# EasyEDA Pro project ProDoc_面部追踪摄像头主控板.epro, board PCB2
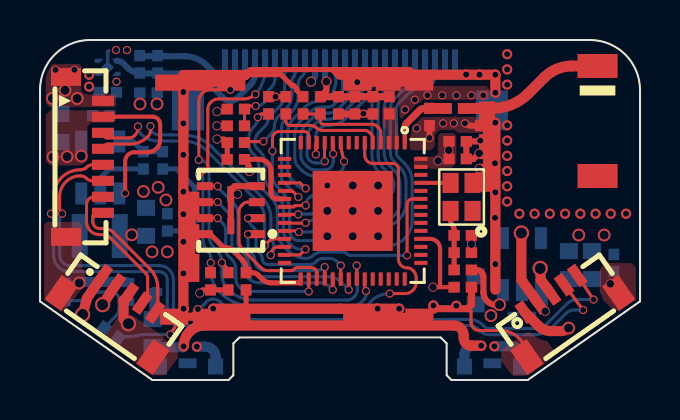
[diagram p1: board, top side]
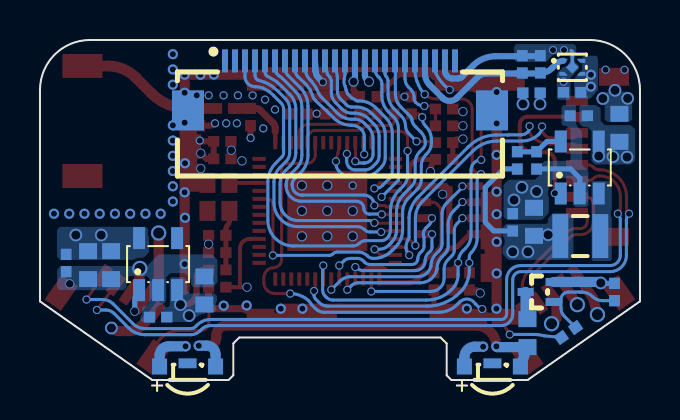
[diagram p2: board, bottom side, seen from below]

Outline 30 x 17 mm; copper layers: Top Layer, Inner1, Inner2, Bottom Layer. Coordinates in mm from the lower left corner of the outline.
Outline path: 0,14.5 arc(0.73,16.27) 2.5,17 27.5,17 arc(29.27,16.27) 30,14.5 30,3.93 24.38,0 20.57,0 20.33,0.24 20.33,1.83 20.03,2.13 9.97,2.13 9.67,1.82 9.67,0.24 9.43,0 5.62,0 0,3.93 0,14.5
Stack: Top Layer 0.035mm 外层铜厚1oz / SUBSTRATE1 0.28mm 7628 RC49% 8.6mil / Inner1 0.035mm 内层铜厚 / Dielectric2 0.28mm 1.1mm H/HOZ Copper / Inner2 0.035mm 内层铜厚 / Dielectric3 0.28mm 7628 RC49% 8.6mil / Bottom Layer 0.035mm 外层铜厚1oz

## Design rules (mm)
net USB-DN1: DP1
net USB-DP1: DP1
net USB-DN2: DP3
net USB-DP2: DP3
net USB-DN3: DP2
net USB-DP3: DP2
spacing copperThickness1oz (default): track to track 0.152, other pairs 0.152 to 0.3
spacing copperThickness2oz: track to track 0.203, other pairs 0.152 to 0.3
spacing Plane_innerPlane: track to track 0.152, other pairs 0.152 to 0.3
spacing Copper_copperRegion: track to track 0.152, other pairs 0.152 to 0.3
spacing Copper_copperRegion1: track to track 0.152, other pairs 0.152 to 0.3
track width copperThickness1oz (default): min 0.127, default 0.254, max 2.54
track width copperThickness2oz: min 0.203, default 0.254, max 2.54
differential pair differentialPair (default): width min 0.127, default 0.254, max 2.54; gap min 0.152, default 0.152
differential pair USB-90Ω: width min 0.152, default 0.157, max 0.203; gap min 0.203, default 0.203
net GND uses copperRegion1_copperThickness1oz
net 3.3V uses copperRegion1_copperThickness1oz
net $1N1778 uses copperRegion1_copperThickness1oz
pour e1121 uses Copper_copperRegion1, copperRegion1_Copper_copperRegion1
pour e1086 uses Copper_copperRegion1, copperRegion1_Copper_copperRegion1
pour e1091 uses Copper_copperRegion, copperRegion1_Copper_copperRegion
pour e1117 uses Copper_copperRegion1, copperRegion1_Copper_copperRegion1
pour e1119 uses Copper_copperRegion1, copperRegion1_Copper_copperRegion1
pour e1079 uses Copper_copperRegion1, copperRegion1_Copper_copperRegion1
pour e1099 uses Copper_copperRegion1, copperRegion1_Copper_copperRegion1
pour e1111 uses Copper_copperRegion1, copperRegion1_Copper_copperRegion1
pour e1113 uses Copper_copperRegion1, copperRegion1_Copper_copperRegion1
pour e1075 uses Copper_copperRegion, copperRegion1_Copper_copperRegion
pour e1077 uses Copper_copperRegion1, copperRegion1_Copper_copperRegion1
pour e1082 uses Copper_copperRegion, copperRegion1_Copper_copperRegion
pour e1084 uses Copper_copperRegion1, copperRegion1_Copper_copperRegion1
pour e1101 uses Copper_copperRegion, copperRegion1_Copper_copperRegion
pour e1105 uses Copper_copperRegion1, copperRegion1_Copper_copperRegion1
pour e1107 uses Copper_copperRegion1, copperRegion1_Copper_copperRegion1
pour e1089 uses Copper_copperRegion1, copperRegion_Copper_copperRegion1
pour e1093 uses Copper_copperRegion1, copperRegion_Copper_copperRegion1
pour e1095 uses Copper_copperRegion, copperRegion_Copper_copperRegion
pour e1097 uses Copper_copperRegion1, copperRegion_Copper_copperRegion1
pour e1103 uses Copper_copperRegion1, copperRegion_Copper_copperRegion1
pour e1109 uses Copper_copperRegion1, copperRegion_Copper_copperRegion1
pour e1115 uses Copper_copperRegion1, copperRegion_Copper_copperRegion1

## Placement (name value [footprint] x y rotation side)
ANT1  CA-C03  [ANT-SMD_CA-C03]  27.88 12.95 270 top
C1  10uF  [0402]  14.92 13.73 90 top
C2  1uF  [0402]  15.74 13.73 90 top
C3  22uF  [0603]  1.03 12.61 270 bottom
C4  100nF  [0402]  16.64 13.73 90 top
C5  100nF  [0402]  9.79 11.03 0 top
C6  100nF  [0402]  20.88 11.06 180 top
C7  100nF  [0402]  21.14 4.64 180 top
C8  1uF  [0402]  20.88 11.93 180 top
C9  100nF  [0402]  10.3 4.94 90 top
C11  1uF  [0402]  13.15 13.73 270 top
C12  100nF  [0402]  24.09 3.14 180 bottom
C13  1nF  [0402]  21.14 7.23 180 top
C14  100nF  [0402]  21.14 6.37 180 top
C15  100nF  [0402]  28.69 5.85 90 bottom
C16  100nF  [0402]  9.79 13.55 0 top
C21  100nF  [0402]  5.88 15.78 270 bottom
C27  100nF  [0402]  3.39 14.39 180 bottom
C28  10uF  [0402]  4.98 15.79 270 bottom
C29  100nF  [0402]  6.36 7.88 90 bottom
C31  100nF  [0402]  3.06 13.22 180 bottom
C32  22uF  [0603]  5.3 7.91 90 bottom
C33  22uF  [0603]  21.78 4.48 270 bottom
C34  22uF  [0603]  26.45 5.75 90 bottom
C35  22uF  [0603]  27.59 5.75 90 bottom
C36  1pF  [0402]  22.01 13.15 90 top
C37  100nF  [0402]  5.42 14.36 180 bottom
CN1  M0800RS-08-GN  [CONN-SMD_M0800RS-08-GN]  2.15 11.16 270 top
CN2  M0800RS-05-GN  [CONN-SMD_M0800RS-05-GN]  3.88 3.49 325 top
CN3  M0800RS-05-GN  [CONN-SMD_M0800RS-05-GN]  26.13 3.49 35 top
FPC1  FPC-05F-24PH20  [FPC-SMD_24P-P0.50_FPC-05F-24PH20]  15 14.77 180 bottom
L1  2nH  [0402]  17.47 13.73 270 top
L3  BLM15PD121SN1D  [0402]  21.14 5.5 0 top
L4  3nH  [0402]  19.47 13.15 90 top
L6  2.2uH  [IND-SMD_L2.5-W2.0_MHCHL2520]  2.99 7.2 180 bottom
LED1  850nm_红外发射管  [LED-SMD_3P-L3.2-W1.5-IR]  22.62 0.72 0 bottom
LED2  850nm_红外发射管  [LED-SMD_3P-L3.2-W1.5-IR]  7.38 0.72 0 bottom
OSC1  40MHz  [OSC-SMD_4P-L2.0-W1.6-BL_S1D25.000000E10F30T]  21.08 9.15 90 top
Q1  2N7002KT  [SOT-523_L1.6-W0.8-P0.95-LS1.6-BR]  5.02 4.4 180 bottom
R1  10kΩ  [0402]  14.02 13.73 90 top
R2  45.3kΩ  [0402]  6.14 10.98 270 bottom
R3  10kΩ  [0402]  12.29 13.73 90 top
R4  4.7kΩ  [0402]  9.79 11.87 180 top
R5  4.7kΩ  [0402]  9.79 12.71 180 top
R6  4.7kΩ  [0402]  8.52 4.94 270 top
R7  4.7kΩ  [0402]  9.41 4.94 270 top
R8  10kΩ  [0402]  11.43 13.73 270 top
R9  10kΩ  [0402]  5.17 10.98 90 bottom
R10  10kΩ  [0402]  1.27 4.4 270 bottom
R11  10Ω  [0402]  3.57 2.37 325 bottom
R12  100Ω  [0603]  5.63 2.34 270 bottom
R13  0Ω  [0402]  20.74 13.58 0 top
U1  ESP32-S3R8  [QFN-56_L7.0-W7.0-P0.40-TL-EP4.0]  15.64 8.46 270 top
U2  W25Q32JWUUIQ  [USON-8_L4.0-W3.0-P0.80-BL_WINBOND_UU]  9.54 8.49 90 top
U3  RT9013-12GB  [SOT-23-5_L3.0-W1.7-P0.95-LS2.8-BR]  24.09 5.79 270 bottom
U5  ICSRC4408SFR  [屏蔽夹 4.4*0.8]  19.67 3.57 180 top
U6  ICSRC4408SFR  [屏蔽夹 4.4*0.8]  10.52 3.57 180 top
U7  ICSRC4408SFR  [屏蔽夹 4.4*0.8]  7.17 9.42 270 top
U8  ICSRC4408SFR  [屏蔽夹 4.4*0.8]  10.27 15.27 180 top
U9  ICSRC4408SFR  [屏蔽夹 4.4*0.8]  19.67 15.27 180 top
U10  MY-PBZ-01-R  [CONN-SMD_MY-PBZ-01-R]  14.97 9.42 270 top
U12  SK6018D4-28  [XDFN-4_L1.0-W1.0-P0.65-BL-EP]  3.38 15.63 270 bottom
U15  ICSRC4408SFR  [屏蔽夹 4.4*0.8]  22.75 9.42 90 top
U16  TLV62569DBVR  [SOT-23-5_L3.0-W1.7-P0.95-LS2.8-BR]  3.01 10.63 270 bottom

## Footprints (pads in the part's own frame, mm; a bottom-side part is the same pattern mirrored in y, then rotated)
0402
  rect 0.566x0.54 smd: 1(-0.433,0) 2(0.433,0)
0603
  rect 0.8x0.9 smd: 1(-0.7,0) 2(0.7,0)
ANT-SMD_CA-C03
  rect 1.2x2 smd: 1(-2.75,0) 2(2.75,0)
CONN-SMD_M0800RS-05-GN
  rect 0.5x1.1 smd: 1(-1.6,1) 2(-0.8,1) 3(0,1) 4(0.8,1) 5(1.6,1)
  rect 1x1.5 smd: 6(2.8,-0.9) 7(-2.8,-0.9)
CONN-SMD_M0800RS-08-GN
  rect 0.5x1.1 smd: 1(-2.8,1) 2(-2,1) 3(-1.2,1) 4(-0.4,1) 5(0.4,1) 6(1.2,1) 7(2,1) 8(2.8,1)
  rect 0.9x1.5 smd: 9(4,-0.85) 10(-4,-0.85)
CONN-SMD_MY-PBZ-01-R
  rect 0.1x0.5 smd: 1(-5.85,0) 2(5.85,0)
  rect 0.5x0.1 smd: 3(3,7.8) 4(-3,-7.8)
FPC-SMD_24P-P0.50_FPC-05F-24PH20
  rect 0.3x1.15 smd: 1(-5.75,1.188) 2(-5.25,1.188) 3(-4.75,1.188) 4(-4.25,1.188) 5(-3.75,1.188) 6(-3.25,1.188) 7(-2.75,1.188) 8(-2.25,1.188) 9(-1.75,1.188) 10(-1.25,1.188) 11(-0.75,1.188) 12(-0.25,1.188) 13(0.25,1.188) 14(0.75,1.188) 15(1.25,1.188) 16(1.75,1.188) 17(2.25,1.188) 18(2.75,1.188) 19(3.25,1.188) 20(3.75,1.188) 21(4.25,1.188) 22(4.75,1.188) 23(5.25,1.188) 24(5.75,1.188)
  rect 1.6x2 smd: 25(7.6,-1.288) 26(-7.6,-1.288)
IND-SMD_L2.5-W2.0_MHCHL2520
  rect 0.8x2.2 smd: 1(-1,0) 2(1,0)
LED-SMD_3P-L3.2-W1.5-IR
  rect 0.75x0.8 smd: 1(-1.4,0.05) 2(1.4,0.05)
  rect 0.9x0.49 smd: 3(0,-0.11)
OSC-SMD_4P-L2.0-W1.6-BL_S1D25.000000E10F30T
  rect 1x0.8 smd: 1(-0.7,-0.55) 2(0.7,-0.55) 3(0.7,0.55) 4(-0.7,0.55)
QFN-56_L7.0-W7.0-P0.40-TL-EP4.0
  rect 0.665x0.2 smd: 1(-3.408,2.6) 2(-3.408,2.2) 3(-3.408,1.8) 4(-3.408,1.4) 5(-3.408,1) 6(-3.408,0.6) 7(-3.408,0.2) 8(-3.408,-0.2) 9(-3.408,-0.6) 10(-3.408,-1) 11(-3.408,-1.4) 12(-3.408,-1.8) 13(-3.408,-2.2) 14(-3.408,-2.6) 29(3.408,-2.6) 30(3.408,-2.2) 31(3.408,-1.8) 32(3.408,-1.4) 33(3.408,-1) 34(3.408,-0.6) 35(3.408,-0.2) 36(3.408,0.2) 37(3.408,0.6) 38(3.408,1) 39(3.408,1.4) 40(3.408,1.8) 41(3.408,2.2) 42(3.408,2.6)
  rect 0.2x0.665 smd: 15(-2.6,-3.408) 16(-2.2,-3.408) 17(-1.8,-3.408) 18(-1.4,-3.408) 19(-1,-3.408) 20(-0.6,-3.408) 21(-0.2,-3.408) 22(0.2,-3.408) 23(0.6,-3.408) 24(1,-3.408) 25(1.4,-3.408) 26(1.8,-3.408) 27(2.2,-3.408) 28(2.6,-3.408) 43(2.6,3.408) 44(2.2,3.408) 45(1.8,3.408) 46(1.4,3.408) 47(1,3.408) 48(0.6,3.408) 49(0.2,3.408) 50(-0.2,3.408) 51(-0.6,3.408) 52(-1,3.408) 53(-1.4,3.408) 54(-1.8,3.408) 55(-2.2,3.408) 56(-2.6,3.408)
  rect 4x4 smd: 57(0,0)
SOT-23-5_L3.0-W1.7-P0.95-LS2.8-BR
  rect 1.1x0.6 smd: 1(1.3,-0.95) 2(1.3,0) 3(1.3,0.95) 4(-1.3,0.95) 5(-1.3,-0.95)
SOT-523_L1.6-W0.8-P0.95-LS1.6-BR
  rect 0.8x0.4 smd: 1(0.7,-0.5) 2(0.7,0.5) 3(-0.7,0)
USON-8_L4.0-W3.0-P0.80-BL_WINBOND_UU
  rect 0.4x0.8 smd: 1(-1.2,-1.3) 2(-0.4,-1.3) 3(0.4,-1.3) 4(1.2,-1.3) 5(1.2,1.3) 6(0.4,1.3) 7(-0.4,1.3) 8(-1.2,1.3)
  rect 0.8x0.35 smd: 9(-0.802,0) 10(0.798,0)
XDFN-4_L1.0-W1.0-P0.65-BL-EP
  custom 0.2x0.4 smd: 1(-0.325,-0.45) 2(0.325,-0.475) 3(0.325,0.475) 4(-0.325,0.475)
  rect 0.45x0.45 smd rot 135: 5(0,0)
屏蔽夹 4.4*0.8
  custom 4.51x0.8 smd: 1(2.255,0.4)

## Nets
As in the schematic.

Pads without a net: ANT1 2; FPC1 1 2 24; LED1 3; LED2 3; OSC1 1; U1 7 8 14 15 16 17 28 38 39 40 41 42 43 44 45 47 48 49 50 52 54; U3 4

## Via types
v1: diameter 0.508, hole 0.305, Top Layer to Bottom Layer, 45 vias
v2: diameter 0.406, hole 0.305, Top Layer to Bottom Layer, 68 vias
v3: diameter 0.457, hole 0.381, Top Layer to Bottom Layer, 14 vias
v4: diameter 0.508, hole 0.406, Top Layer to Bottom Layer, 10 vias
v5: diameter 0.635, hole 0.457, Top Layer to Bottom Layer, 20 vias
v6: diameter 0.762, hole 0.559, Top Layer to Bottom Layer, 5 vias

## Routing (per net, layer and track width the routed paths; a pad name or vN(x,y) marks a point on that pad's centre or on a via; arc(x,y) is an arc through that point)
1.2V: length 29.1
  Top Layer w0.508: CN2.1 2.35,4.1 v6(2.13,3.27) ; CN3.1 24.93,2.7 arc(25.21,2.51) 25.54,2.45 26.06,2.45 arc(26.26,2.49) v5(26.43,2.6)
  Inner2 w0.508: v6(2.13,3.27) 1.42,3.98 arc(1.15,4.38) 1.06,4.86 1.06,5.25 arc(1.17,5.85) 1.51,6.36 2.06,6.91 arc(2.61,7.73) 2.81,8.7 2.81,12.68 arc(3.13,13.47) 3.93,13.8 v5(5,13.8) arc(5.39,14.73) 6.32,15.12 13.35,15.12 v4(13.55,14.92)
  Bottom Layer w0.305: 5,14.36 v5(5,13.8) ; v4(13.55,14.92) 13.68,15.05 arc(13.74,15.13) 13.76,15.23 13.76,15.94 arc(13.75,15.95) FPC1.15
  vias: v5(26.94,7.25) v5(28.21,7.25)
2.8V: length 8.9
  Bottom Layer w0.305: 10.75,16.16 10.75,15.32 arc(10.69,15.01) 10.52,14.75 9.86,14.09 arc(9.85,14.09) 9.85,14.08 arc(9.51,13.95) 9.18,14.08 arc(9.18,14.08) 9.17,14.09 8.11,15.15 arc(7.92,15.28) 7.7,15.32 6.19,15.32 arc(6.18,15.33) 6.18,15.33 5.29,15.33 ; C28.2 arc(4.66,15.42) 4.39,15.6 4.17,15.82 arc(4.01,15.92) U12.1
3.3V: length 34.9
  Top Layer w0.203: U1.46 19.51,7.06 arc(19.86,6.91) 20,6.56 20,4.64 ; 20,4.64 v3(19.65,4.64) ; 20,4.64 C7.2
  Top Layer w0.254: 12.29,14.17 v2(11.77,14.17) 11.43,14.17 ; R5.2 v3(8.85,12.71) ; v3(7.99,4.35) 8.15,4.5 R6.2 R7.2 ; U1.20 11.87,9.06 arc(11.64,9.15) 11.55,9.38 11.55,10.45 arc(11.37,10.86) 10.96,11.03 C5.2
  Top Layer w0.305: 14.02,14.17 14.32,14.47 v4(14.32,14.92) ; L3.2 21.82,5.5 arc(22.07,5.4) 22.17,5.16 22.17,4.37 arc(22.43,3.88) v5(22.98,3.77) ; C5.2 arc(10.41,10.75) v3(10.48,10.42)
  Top Layer w0.35: 17.47,14.17 14.02,14.17
  Top Layer w0.508: v6(24.07,7.35) 24.07,5.01 CN3.2 ; 3.79,4.77 v6(3.13,3.77)
  Bottom Layer w0.254: 6.36,7.46 7.31,7.46 7.74,7.88 7.74,9.64 6.81,10.56 6.14,10.56 ; v3(25.26,3.44) 25.26,3.97 arc(25.21,4.25) U3.1
  Bottom Layer w0.305: 14.25,16.16 14.25,14.99 v4(14.32,14.92)
  Bottom Layer w0.508: LED2.2 8.78,1.15 arc(8.63,1.52) 8.26,1.67 v1(7.84,1.67) ; LED1.2 24.02,1.23 arc(23.89,1.55) 23.57,1.69 v1(22.72,1.69)
  vias: v1(2.45,15.26) v1(2.45,14.67) v3(19.9,10.96) v3(20.44,11.49) v5(4.59,7.26) v5(5.6,6.41) v5(6.36,6.41) v5(22.55,3.22)
GND: length 92.4
  Top Layer w0.152: 21.43,3.57 21.55,3.44 21.55,2.89 arc(21.68,2.59) 21.97,2.47 23.02,2.47 arc(23.96,2.08) CN3.7
  Top Layer w0.254: C13.1 v3(21.57,6.79) C14.1 ; v3(8.85,13.42) 9.23,13.42 C16.1 ; C9.1 10.3,3.6 10.27,3.57 ; 14.6,15.52 18.49,15.52 18.74,15.27 ; 14.6,15.52 14.86,15.27 U10.1 ; 14.6,15.52 10.52,15.52 10.27,15.27 12.05,15.27 12.59,14.73 12.67,14.73 12.84,14.56 12.84,14.48 13.15,14.17 ; C5.1 R4.2 9.18,12.05 v3(8.85,12.05)
  Top Layer w0.305: L4.1 19.47,12.11 arc(19.47,12.1) v2(19.47,12.1) ; v3(21.96,10.58) 21.96,10.19 arc(21.86,9.95) 21.63,9.85 ; U2.4 9.72,9.69 9.54,9.51 U2.10 ; v3(21.96,11.34) 21.68,11.06 C6.1 C8.1 21.97,11.93 v2(22.01,11.97) ; U2.10 v3(9.87,9.29) ; U2.10 U2.9 ; C36.1 21.54,12.71 arc(21.38,12.75) v2(21.25,12.84)
  Top Layer w0.35: 19.67,3.57 21.38,3.57 21.57,3.76 C7.1 ; C4.1 16.19,13.3 v2(16.17,13.32) 16.15,13.3 C2.1 C1.1
  Top Layer w0.508: 22.77,12.81 22.77,4.52 ; v6(4.42,2.82) 4.18,3.06 4.18,3.98 4.38,4.18 CN2.3 ; v6(25.01,5.58) 25.03,5.01 25.55,4.31 ; v1(7.18,3.57) 7.17,3.58 v1(7.17,5.33) v1(7.17,6.91) v1(7.17,8.29) v1(7.17,9.42) v1(7.17,11.26) U10.4 v1(7.17,12.83) v1(7.17,14.4) 7.17,15.24 7.18,15.25 10.25,15.25 10.27,15.27 ; v1(8.66,3.57) U10.2 v1(16.88,3.57) v1(17.96,3.57) ; 15,15.27 v1(21.98,15.27) 22.76,15.27 22.77,15.25 v1(22.77,14.36) ; 19.67,3.57 19.67,3.73
  Bottom Layer w0.178: U12.5 3.38,16.41 3.44,16.47
  Bottom Layer w0.254: 5.17,10.56 3.48,10.56 3.01,10.09 U16.2 ; R10.1 1.92,4.83 arc(1.94,4.84) v5(1.96,4.85)
  Bottom Layer w0.305: 5.29,16.19 6.18,16.19 arc(6.18,16.19) 6.19,16.19 7.21,16.19 arc(7.83,16.07) 8.35,15.72 8.84,15.23 arc(8.88,15.17) 8.95,15.12 arc(9.02,15.09) 9.1,15.08 9.4,15.08 arc(9.41,15.08) 9.42,15.08 arc(9.56,15.12) 9.67,15.23 arc(9.73,15.33) 9.75,15.44 FPC1.23 ; FPC1.10 16.21,15.38 arc(16.19,15.28) 16.14,15.2 16.07,15.1 v2(15.86,14.89) ; 5.85,14.36 v5(5.85,13.8)
  Bottom Layer w0.508: Q1.2 3.27,4.9 arc(3.25,4.91) 3.22,4.91 arc(3.14,4.91) 3.07,4.91 arc(3.05,4.91) 3.04,4.91 arc(3.02,4.91) 2.99,4.9 2.08,4.9 arc(2.05,4.9) 2.02,4.89 arc(1.99,4.87) v5(1.96,4.85)
  vias: v2(0.78,15.51) v2(1.72,15.51) v2(3.8,16.5) v2(3.82,14.92) v2(4.35,16.5) v2(14.37,9.73) v2(18.25,13.52) v2(18.75,14.02) v2(18.84,12.58) v2(19.37,14.23) v2(20.1,14.23) v2(20.16,12.84) v2(20.69,12.84) v2(20.82,14.23) v2(21.57,14.23) v2(22.16,14.23) v1(19.67,3.73) v1(20.82,3.72) v1(21.31,15.27) v1(22.77,15.27) v1(22.77,12.87) v1(22.75,10.84) v1(22.77,9.38) v1(22.75,8.11) v1(22.77,5.79) v1(23.36,16.29) v1(23.36,15.53) v1(23.36,14.77) v1(23.36,12.73) v1(23.36,11.97) v1(23.36,11.21) v1(23.36,10.45) v1(23.36,9.69) v1(23.36,8.92) v1(23.97,8.31) v1(24.73,8.31) v1(25.49,8.31) v1(26.25,8.31) v1(27.01,8.31) v1(27.78,8.31) v1(28.54,8.31) v1(29.3,8.31) v4(14.37,8.46) v4(14.37,7.19) v4(15.64,9.73) v4(15.64,8.46) v4(15.64,7.19) v4(16.91,9.73) v4(16.91,8.46) v4(16.91,7.19) v5(0.62,14.08) v5(1.25,14.48) v5(1.86,14.07) v5(5.17,9.43) v5(5.91,9.64) v5(6.3,9) v3(28.51,4.81)
VDD_SPI: length 6.1
  Top Layer w0.203: 12.92,4.86 13.04,4.98 U1.29
  Top Layer w0.254: 8.24,7.29 8.51,7.29 9.1,6.7 arc(9.19,6.64) 9.3,6.62 arc(9.49,6.58) 9.65,6.47 10.13,5.99 arc(10.26,5.81) 10.3,5.59 C9.2 10.61,5.37 arc(10.77,5.34) 10.92,5.24 11.12,5.04 arc(11.32,4.91) 11.55,4.86 12.92,4.86
VIN: length 8.1
  Top Layer w0.203: CN1.2 3.15,13.17 5.62,13.17 arc(5.89,13.05) 6.01,12.78 6.01,12.02 arc(5.99,11.86) 5.93,11.72 arc(5.82,11.57) 5.68,11.47 arc(5.53,11.41) 5.38,11.39 4.71,11.39 arc(4.39,11.25) 4.26,10.93 v2(4.26,9.34)
  Bottom Layer w0.254: U16.1 4.24,9.33 v2(4.26,9.34)
  vias: v5(0.65,11.15) v5(1.35,11.17) v5(2.06,11.2)
BOOT0: length 5.3
  Top Layer w0.152: R3.1 12.29,12.95 arc(12.35,12.79) 12.51,12.73 13.52,12.73 arc(13.69,12.7) 13.83,12.6 arc(13.97,12.51) 14.13,12.48 16.24,12.48 arc(16.37,12.45) 16.48,12.38 16.55,12.3 arc(16.61,12.21) 16.64,12.1 U1.5
CAM_RST: length 4.2
  Top Layer w0.152: v2(10.78,13.7) 10.23,13.7 10.23,12.81
  Bottom Layer w0.152: FPC1.19 11.75,15.07 arc(11.7,14.84) 11.57,14.64 11.46,14.52 arc(11.33,14.34) 11.29,14.13 11.29,14.06 arc(11.27,13.96) 11.22,13.88 arc(11.02,13.75) 10.79,13.7 v2(10.78,13.7)
CHIP_EN: length 5.1
  Top Layer w0.152: U1.4 17.04,12.36 arc(17.01,12.49) 16.94,12.6 16.86,12.68 arc(16.74,12.76) 16.6,12.78 14.16,12.78 arc(14.06,12.83) 14.02,12.93 R1.1 C11.2
CSI_D2: length 13.3
  Top Layer w0.152: U1.22 12.25,8.28 v2(12.91,8.28)
  Bottom Layer w0.152: FPC1.6 18.25,15.52 arc(18.23,15.42) 18.17,15.33 18.06,15.22 arc(18.04,15.2) 18.02,15.18 ; v2(12.91,8.28) 12.93,8.3 13.53,8.3 arc(13.73,8.38) 13.81,8.57 arc(13.91,8.83) 14.18,8.94 16.93,8.94 arc(17.47,9.16) 17.69,9.7 17.69,9.8 arc(17.64,10.05) 17.5,10.26 17.18,10.58 arc(16.98,10.89) 16.91,11.25 16.91,13.64 arc(16.94,13.91) 17.03,14.16 arc(17.08,14.25) 17.15,14.34 arc(17.19,14.39) 17.23,14.43 17.89,15.09 arc(17.95,15.14) 18.01,15.18
CSI_D3: length 15.1
  Top Layer w0.152: v2(12.94,7.4) 12.89,7.46 U1.24
  Bottom Layer w0.152: FPC1.4 19.25,15.24 arc(19.23,15.14) 19.18,15.05 arc(19.14,15.02) 19.09,14.99 18.76,14.89 arc(18.41,14.69) 18.1,14.44 17.73,14.07 arc(17.57,13.83) 17.52,13.54 17.52,11.37 arc(17.56,11.13) 17.7,10.93 18.01,10.62 arc(18.23,10.29) 18.3,9.9 18.3,8.87 arc(18.27,8.57) 18.16,8.3 arc(17.95,8.02) 17.67,7.81 arc(17.4,7.71) 17.1,7.67 14.14,7.67 arc(13.94,7.63) 13.77,7.51 arc(13.64,7.43) 13.5,7.4 v2(12.94,7.4)
CSI_D4: length 23.9
  Top Layer w0.152: U1.13 13.44,12.22 arc(13.37,12.36) 13.23,12.42 11.97,12.42 arc(11.72,12.32) 11.62,12.07 v2(11.62,11.45)
  Bottom Layer w0.152: 17.91,11.14 18.22,10.83 arc(18.51,10.41) 18.61,9.9 18.61,7.98 arc(18.23,7.08) 17.33,6.7 14.36,6.7 arc(14.18,6.74) 14.03,6.84 arc(13.89,6.93) 13.72,6.97 12.93,6.97 arc(12.78,7) 12.66,7.08 arc(12.6,7.14) 12.56,7.21 arc(12.5,7.36) 12.48,7.51 12.48,8.45 arc(12.37,9.01) 12.05,9.49 arc(12.02,9.52) 11.99,9.55 11.86,9.68 arc(11.68,9.94) 11.62,10.25 v2(11.62,11.45) ; FPC1.3 19.75,15.17 arc(19.6,14.81) 19.24,14.66 arc(19.03,14.64) 18.83,14.59 arc(18.56,14.43) 18.32,14.23 17.96,13.86 arc(17.85,13.71) 17.82,13.53 17.82,11.37 arc(17.84,11.25) 17.91,11.14
CSI_D5: length 14.3
  Top Layer w0.152: U1.23 12.24,7.84 13.27,7.84 v2(13.28,7.86)
  Bottom Layer w0.152: FPC1.5 arc(18.75,15.64) 18.73,15.33 arc(18.71,15.25) 18.64,15.2 18.19,14.93 arc(18.04,14.81) 17.91,14.67 17.52,14.29 arc(17.29,13.95) 17.21,13.54 17.21,11.37 arc(17.28,11.01) 17.48,10.71 17.71,10.48 arc(17.92,10.16) 18,9.8 18,8.88 arc(17.97,8.67) 17.9,8.47 arc(17.73,8.24) 17.5,8.07 arc(17.3,8) 17.09,7.97 13.56,7.97 arc(13.41,7.94) v2(13.28,7.86)
CSI_D6: length 12.9
  Top Layer w0.152: v2(13.28,8.73) 13.24,8.77 13.15,8.77 13.09,8.72 12.74,8.72 12.68,8.66 U1.21
  Bottom Layer w0.152: 17.75,16.16 17.75,15.58 arc(17.71,15.4) 17.61,15.24 16.99,14.62 arc(16.7,14.19) 16.6,13.68 16.6,11.25 arc(16.7,10.77) 16.96,10.37 17.28,10.05 arc(17.36,9.93) 17.39,9.8 17.39,9.77 arc(17.39,9.76) 17.39,9.75 arc(17.39,9.74) 17.39,9.73 arc(17.25,9.38) 16.91,9.24 arc(16.89,9.24) 16.88,9.24 arc(16.87,9.24) 16.86,9.24 13.8,9.24 arc(13.43,9.09) v2(13.28,8.73)
CSI_D7: length 8.5
  Top Layer w0.152: U1.11 14.22,11.85 14.22,10.95 v2(14.24,10.94)
  Bottom Layer w0.152: FPC1.9 16.75,15.63 arc(16.68,15.29) 16.49,15 16.42,14.93 16.23,14.66 16.06,14.33 arc(16.01,14.24) 15.95,14.16 15.11,13.32 arc(14.79,13.11) 14.42,13.04 14.27,13.04 arc(14,12.99) 13.78,12.83 13.6,12.65 arc(13.41,12.38) 13.35,12.05 13.35,11.29 arc(13.38,11.13) 13.47,10.99 arc(13.47,10.99) 13.48,10.98 arc(13.48,10.98) 13.48,10.98 ; v2(14.24,10.94) 14.15,10.85 13.81,10.85 arc(13.8,10.85) 13.8,10.85 arc(13.79,10.85) 13.79,10.85 arc(13.62,10.88) 13.48,10.98
CSI_D8: length 9.3
  Top Layer w0.152: v2(14.66,11.31) 14.66,11.84 U1.10
  Bottom Layer w0.152: FPC1.11 15.63,15.29 15.51,15.15 15.5,15.12 arc(15.46,15.06) 15.44,14.99 15.43,14.96 15.43,14.37 arc(15.38,14.1) 15.23,13.87 14.89,13.54 arc(14.68,13.39) 14.42,13.34 14.27,13.34 arc(13.89,13.27) 13.56,13.05 13.29,12.78 arc(13.11,12.5) 13.04,12.18 13.04,11.21 arc(13.08,11) 13.2,10.83 13.35,10.67 arc(13.54,10.55) 13.76,10.51 14.24,10.51 arc(14.4,10.54) 14.54,10.63 arc(14.63,10.77) 14.67,10.94 14.67,11.12 14.66,11.13 v2(14.66,11.31)
CSI_D9: length 9.3
  Top Layer w0.152: U1.18 13,9.86 v2(13.28,9.58)
  Bottom Layer w0.152: FPC1.13 14.75,15.28 14.79,15.04 arc(14.8,14.87) 14.75,14.7 14.7,14.51 14.62,14.31 14.42,14.11 14.13,13.95 14.03,13.95 arc(13.59,13.87) 13.22,13.62 12.7,13.1 arc(12.47,12.75) 12.38,12.33 12.38,10.44 arc(12.42,10.24) 12.54,10.07 12.88,9.72 arc(13.04,9.61) 13.23,9.58 v2(13.28,9.58)
CSI_HSYNC: length 8.3
  Top Layer w0.152: v2(12.92,9.15) 12.61,9.46 U1.19
  Bottom Layer w0.152: v2(12.92,9.15) 12.08,9.99 ; 12.08,9.99 12.08,12.59 arc(12.14,12.89) 12.3,13.14 12.58,13.42 arc(12.82,13.77) 12.9,14.19 12.9,14.8 arc(12.94,14.97) 13.04,15.11 13.09,15.17 arc(13.21,15.34) 13.25,15.55 FPC1.16
CSI_MCLK: length 10.5
  Top Layer w0.152: v2(15.2,10.93) arc(15.16,11.15) 15.1,11.36 arc(15.05,11.61) U1.9
  Bottom Layer w0.152: v2(15.2,10.93) 15.2,10.81 arc(15.16,10.61) 15.05,10.44 15.02,10.41 arc(14.79,10.26) 14.52,10.2 13.77,10.2 arc(13.4,10.27) 13.09,10.48 12.92,10.65 arc(12.79,10.85) 12.74,11.1 12.74,12.29 arc(12.81,12.63) 13,12.92 13.41,13.33 arc(13.76,13.57) 14.18,13.65 14.42,13.65 arc(14.56,13.68) 14.68,13.76 14.97,14.04 arc(15.08,14.22) 15.13,14.43 15.13,15.1 FPC1.12
CSI_PCLK: length 7.2
  Top Layer w0.152: U1.12 13.79,11.82 v2(13.79,11.28)
  Bottom Layer w0.152: v2(13.79,11.28) 13.79,12.18 arc(13.83,12.37) 13.94,12.53 arc(14.16,12.68) 14.42,12.73 arc(14.91,12.83) 15.32,13.11 15.68,13.46 16.23,13.98 arc(16.28,14.04) 16.33,14.1 16.49,14.5 16.68,14.76 16.77,14.85 17.12,15.18 arc(17.21,15.33) 17.25,15.51 17.25,16.16
CSI_VSYNC: length 12.4
  Top Layer w0.152: U1.27 12.99,6.26 v2(13.27,6.53)
  Bottom Layer w0.152: v2(13.27,6.53) 13.06,6.53 arc(12.79,6.59) 12.56,6.74 12.49,6.82 arc(12.47,6.84) 12.44,6.86 arc(12.44,6.87) 12.43,6.87 12.43,6.87 arc(12.39,6.92) 12.35,6.96 arc(12.27,7.09) 12.21,7.24 arc(12.19,7.31) 12.18,7.38 12.18,7.39 arc(12.18,7.45) 12.17,7.51 12.17,8.43 arc(12.09,8.88) 11.84,9.26 arc(11.83,9.27) 11.82,9.28 arc(11.8,9.31) 11.77,9.33 11.42,9.68 arc(11.29,9.88) 11.24,10.12 11.24,10.86 arc(11.18,11.16) 11.01,11.41 10.85,11.58 arc(10.76,11.7) 10.73,11.85 arc(10.79,12.15) 10.96,12.4 11.24,12.68 arc(11.34,12.81) 11.4,12.96 arc(11.4,13.01) 11.42,13.06 arc(11.45,13.13) 11.49,13.18 11.95,13.65 arc(12.02,13.71) 12.07,13.79 arc(12.1,13.84) 12.13,13.89 arc(12.19,14.05) 12.23,14.23 arc(12.23,14.27) 12.23,14.32 12.23,16.11 arc(12.24,16.14) 12.25,16.16
IR_LED: length 25.3
  Top Layer w0.152: v2(7.89,3.55) 7.52,3.17 arc(7.41,3.1) 7.29,3.08 arc(7.14,3.05) 7.01,2.96 6.85,2.81 v2(6.51,2.28) ; v2(17.49,4.32) 18.25,4.32 arc(18.65,4.49) 18.81,4.88 18.81,5.09 arc(18.77,5.3) 18.65,5.48 18.64,5.49 arc(18.51,5.58) 18.35,5.61 arc(18.05,5.74) 17.92,6.04 17.92,10.52 arc(17.83,10.74) 17.62,10.83 16.65,10.83 arc(16.36,10.95) 16.24,11.24 U1.6
  Bottom Layer w0.152: R11.2 4.78,2.21 arc(5.04,2.26) 5.3,2.28 v2(6.51,2.28) ; v2(7.89,3.55) arc(7.96,3.56) 8.02,3.6 8.21,3.79 arc(8.23,3.81) 8.25,3.82 arc(8.6,4.05) 9,3.91 9.01,3.91 9.15,3.77 arc(9.57,3.49) 10.07,3.39 15.79,3.39 arc(16.02,3.43) 16.22,3.57 16.42,3.77 arc(16.49,3.88) 16.58,3.97 arc(17,4.23) v2(17.49,4.32)
LNA_IN: length 3.3
  Top Layer w0.203: 18.24,12.4 18.24,12.4 U1.1
  Top Layer w0.35: 18.24,12.4 18.24,12.6 arc(18.26,12.74) 18.34,12.85 18.99,13.49 arc(19.08,13.56) 19.19,13.58 L4.2
  Top Layer w0.541: L4.2 20.31,13.58 arc(20.31,13.58) R13.1
PWDN: length 5.5
  Top Layer w0.152: 10.23,11.92 11.17,11.92 v2(11.17,11.93)
  Bottom Layer w0.152: FPC1.17 12.75,15.32 arc(12.73,15.24) 12.69,15.17 arc(12.62,15.07) 12.6,14.95 12.6,14.3 arc(12.52,13.89) 12.29,13.55 11.92,13.18 arc(11.77,12.96) 11.72,12.71 arc(11.68,12.5) 11.56,12.32 v2(11.17,11.93)
SPICLK: length 9.9
  Top Layer w0.152: U2.6 8.87,8.89 v2(8.88,8.9) ; U1.33 v2(14.64,4.51)
  Bottom Layer w0.152: v2(14.64,4.51) 14.43,4.72 arc(14.27,4.82) 14.08,4.86 10.99,4.86 arc(10.45,5.05) 10.15,5.55 arc(10.08,5.89) 9.89,6.17 9.75,6.31 arc(9.63,6.49) 9.59,6.7 9.59,7.77 arc(9.52,8.14) 9.31,8.47 arc(9.3,8.47) 9.29,8.48 v2(8.88,8.9)
SPICS0: length 6.3
  Top Layer w0.152: v2(10.4,7.29) 10.84,7.29 ; U1.32 v2(14.24,5.65)
  Bottom Layer w0.152: v2(10.4,7.29) 10.4,6.64 arc(10.42,6.53) 10.48,6.44 10.59,6.33 arc(10.71,6.16) 10.74,5.97 arc(10.89,5.61) 11.24,5.47 13.81,5.47 arc(14.04,5.52) v2(14.24,5.65)
SPID: length 11.2
  Top Layer w0.152: v2(8.88,9.69) 8.87,9.69 U2.5 ; U1.35 v2(15.44,4.51)
  Bottom Layer w0.152: v2(15.44,4.51) 15.02,4.93 arc(14.76,5.1) 14.45,5.17 11.12,5.17 arc(10.69,5.32) 10.45,5.71 arc(10.45,5.78) 10.44,5.85 arc(10.41,5.96) 10.38,6.05 arc(10.31,6.17) 10.21,6.28 10.05,6.45 arc(9.97,6.55) 9.92,6.67 arc(9.9,6.74) 9.9,6.82 9.9,8.31 arc(9.86,8.55) 9.75,8.75 arc(9.72,8.79) 9.68,8.83 8.92,9.6 arc(8.89,9.64) v2(8.88,9.69)
SPIHD: length 8.6
  Top Layer w0.152: v2(8.88,8.09) U2.7 ; U1.30 v2(13.44,4.43)
  Bottom Layer w0.152: v2(8.88,8.09) 9.14,7.83 arc(9.25,7.67) 9.28,7.48 9.28,6.49 arc(9.31,6.34) 9.4,6.22 9.6,6.02 arc(9.74,5.8) 9.79,5.55 9.79,5.09 arc(9.99,4.62) 10.45,4.43 v2(13.44,4.43)
SPIQ: length 7.7
  Top Layer w0.152: U1.34 v2(15.04,5.72) ; v2(10.4,8.09) U2.2
  Bottom Layer w0.152: v2(15.04,5.72) 14.82,5.94 arc(14.67,6.04) 14.49,6.08 14.13,6.08 arc(13.97,6.05) 13.84,5.96 13.77,5.89 arc(13.64,5.8) 13.49,5.77 11.4,5.77 arc(11.19,5.86) 11.11,6.06 arc(11.08,6.22) 10.99,6.36 10.91,6.44 arc(10.83,6.56) 10.8,6.7 10.8,7.13 arc(10.82,7.21) 10.83,7.29 arc(10.8,7.46) 10.71,7.6 arc(10.69,7.61) 10.68,7.62 10.54,7.76 arc(10.44,7.91) v2(10.4,8.09)
SPIWP: length 7.7
  Top Layer w0.152: U1.31 13.84,5.39 arc(13.82,5.46) 13.78,5.52 arc(13.67,5.6) 13.54,5.62 12.89,5.62 arc(12.8,5.6) 12.72,5.55 arc(12.63,5.49) 12.53,5.47 11.4,5.47 arc(11.21,5.51) 11.04,5.62 10.13,6.53 arc(9.99,6.73) 9.95,6.98 9.95,8.41 arc(9.98,8.58) 10.08,8.73 10.15,8.8 arc(10.25,8.87) 10.38,8.89 U2.3
TWI_SCK: length 23.5
  Top Layer w0.152: U1.37 16.24,4.51 v2(16.3,4.45) ; R6.1 8.53,5.38 v2(8.53,5.86) ; v2(10.77,14.28) arc(10.5,14.11) 10.19,14.06 8.94,14.06 arc(8.72,14.01) 8.53,13.89 arc(8.43,13.73) 8.39,13.54 8.39,10.74 arc(8.26,10.42) v2(7.95,10.3)
  Bottom Layer w0.152: 11.25,16.16 11.25,15.51 arc(11.23,15.23) 11.16,14.95 arc(11.12,14.84) 11.07,14.74 arc(10.94,14.5) v2(10.77,14.28) ; v2(16.3,4.45) 16.3,4.23 arc(16.28,4.13) 16.22,4.05 16.06,3.88 arc(15.84,3.74) 15.59,3.69 10.65,3.69 arc(9.76,3.87) 9,4.37 arc(8.66,4.89) 8.53,5.49 v2(8.53,5.86) 8.53,6.15 arc(8.51,6.26) 8.45,6.36 arc(8.22,6.7) 8.14,7.09 8.14,10.1 arc(8.14,10.11) 8.14,10.12 arc(8.08,10.24) v2(7.95,10.3)
TWI_SDA: length 23.2
  Top Layer w0.152: U1.36 v2(15.84,5.72) ; v2(7.94,11.01) 7.94,13.93 arc(8.11,14.34) 8.52,14.51 v2(9.51,14.51) ; v2(9.09,5.86) 9.41,5.55 R7.1
  Bottom Layer w0.152: v2(15.84,5.72) 15.87,5.69 15.87,4.5 arc(15.83,4.33) 15.74,4.2 15.68,4.13 arc(15.53,4.03) 15.35,4 10.68,4 arc(10,4.13) 9.42,4.52 arc(9.18,4.86) 9.09,5.28 v2(9.09,5.86) arc(9.03,6.19) 8.84,6.47 8.73,6.59 arc(8.52,6.9) 8.45,7.26 8.45,10.5 arc(8.3,10.86) v2(7.94,11.01) ; 10.25,16.16 10.25,15.74 arc(10.24,15.52) 10.2,15.31 arc(9.9,14.87) v2(9.51,14.51)
USB-DN1: length 13.5
  Top Layer w0.152: v2(11.23,6.72) 11.45,6.95 arc(11.57,7.03) 11.72,7.06 U1.25 ; v2(4.9,12.67) 4.9,12.61 arc(4.86,12.4) 4.74,12.23 arc(4.6,12.13) 4.44,12.1 3.41,12.1 arc(3.36,12.11) 3.32,12.12 arc(3.19,12.21) CN1.3 arc(3.19,12.22) 3.29,12.11
  Bottom Layer w0.152: v2(11.23,6.72) 11.23,8.09 arc(11.14,8.54) 10.89,8.92 8.35,11.45 arc(7.8,11.82) 7.16,11.95 5.9,11.95 arc(5.44,12.04) 5.04,12.3 arc(4.94,12.46) 4.9,12.65 v2(4.9,12.67)
USB-DN2: length 37.7
  Top Layer w0.152: 26.21,4.77 v2(27.15,3.5) ; CN1.5 2.62,10.76 arc(2.48,10.73) 2.35,10.66 2.26,10.57 2.24,10.57 arc(2.14,10.53) 2.02,10.51 arc(1.07,10.12) 0.67,9.16 0.67,8.62 arc(0.64,8.46) v2(0.55,8.31)
  Bottom Layer w0.152: v2(27.15,3.5) 26.71,3.5 arc(26.49,3.46) 26.29,3.33 25.57,2.61 arc(25.2,2.35) 24.75,2.27 22.45,2.27 arc(22.21,2.31) 22.01,2.45 21.92,2.54 arc(21.83,2.61) 21.72,2.67 arc(21.6,2.71) 21.47,2.72 6.94,2.72 arc(6.53,2.89) 6.36,3.3 6.36,5.01 arc(6.25,5.3) 5.96,5.42 1.5,5.42 arc(0.92,5.66) 0.68,6.23 0.68,8 arc(0.68,8.05) 0.67,8.11 arc(0.62,8.22) v2(0.55,8.31)
USB-DN3: length 7.6
  Top Layer w0.152: CN1.7 2.71,9.16 arc(2.44,9.05) 2.33,8.77 2.33,7.91 arc(2.51,7.46) 2.97,7.27 3.19,7.27 arc(3.34,7.24) 3.46,7.16 5.29,5.33 arc(5.36,5.23) 5.38,5.12 5.38,4.38 arc(5.28,4.09) CN2.4
USB-DP1: length 14.1
  Top Layer w0.152: v2(5.52,12.69) 5.52,12.47 arc(5.49,12.31) 5.4,12.17 arc(4.98,11.9) 4.49,11.8 3.39,11.8 arc(3.22,11.73) CN1.4 ; U1.26 11.9,6.66 arc(11.78,6.63) 11.67,6.56 arc(11.57,6.42) v2(11.54,6.24)
  Bottom Layer w0.152: v2(5.52,12.69) 5.52,12.6 arc(5.54,12.49) 5.6,12.4 arc(5.76,12.3) 5.96,12.26 6.56,12.26 arc(6.58,12.25) 6.6,12.25 7.2,12.25 arc(7.2,12.25) 7.21,12.25 arc(7.94,12.09) 8.57,11.67 arc(8.57,11.66) 8.58,11.66 arc(8.59,11.65) 8.6,11.64 arc(8.6,11.64) 8.6,11.64 arc(8.6,11.63) 8.61,11.63 11.1,9.14 arc(11.3,8.89) 11.44,8.62 arc(11.52,8.38) 11.55,8.12 11.55,7.14 arc(11.56,7.08) 11.6,7.02 arc(11.67,6.82) 11.7,6.61 arc(11.65,6.41) v2(11.54,6.24)
USB-DP2: length 37.2
  Top Layer w0.152: CN3.5 v2(27.67,4.02) ; CN1.6 2.62,9.96 arc(2.46,9.99) 2.32,10.08 arc(2.18,10.17) 2.02,10.21 arc(1.29,9.9) 0.98,9.16 0.98,8.62 arc(1.01,8.46) v2(1.11,8.31)
  Bottom Layer w0.152: v2(27.67,4.02) 26.86,4.02 arc(26.58,3.97) 26.34,3.81 25.36,2.82 arc(25.08,2.64) 24.75,2.57 22.48,2.57 arc(22.33,2.6) 22.2,2.69 22.14,2.75 arc(22.02,2.85) 21.89,2.93 arc(21.69,3) 21.47,3.03 6.94,3.03 arc(6.75,3.11) 6.67,3.3 6.67,5.01 arc(6.46,5.51) 5.96,5.72 1.5,5.72 arc(1.13,5.87) 0.98,6.23 0.98,8.02 arc(1.02,8.18) v2(1.11,8.31)
USB-DP3: length 7
  Top Layer w0.152: CN1.8 2.83,8.36 arc(2.7,8.3) 2.64,8.16 2.64,7.92 arc(2.74,7.68) 2.99,7.57 3.22,7.57 arc(3.45,7.53) 3.66,7.39 5.51,5.54 arc(5.6,5.44) 5.68,5.33 arc(5.84,4.99) 5.89,4.62 5.89,3.7 arc(5.86,3.53) 5.76,3.39
XTAL_N: length 1.5
  Top Layer w0.203: U1.53 20.53,9.86
$1N20382: length 3
  Top Layer w0.254: L3.1 C14.2 C13.2 20.71,7.53 arc(20.68,7.65) 20.61,7.76 arc(20.55,7.85) 20.53,7.96 OSC1.4
$1N20736: length 7.4
  Top Layer w0.541: ANT1.1 26.59,15.7 arc(25.85,15.55) 25.22,15.13 24.41,14.32 arc(23.59,13.77) 22.62,13.58 22.01,13.58 arc(22.01,13.58) 22.01,13.58 R13.2
$1N28125: length 17.6
  Top Layer w0.152: v2(18.35,6.23) 18.35,8.77 arc(18.44,8.97) 18.64,9.06 U1.51 ; v2(10.89,13.14) 11.05,13.3 R8.2
  Bottom Layer w0.152: v2(10.89,13.14) 10.89,13.12 arc(10.84,12.88) 10.71,12.68 arc(10.5,12.37) 10.43,12.01 10.43,11.85 arc(10.49,11.56) 10.65,11.32 10.71,11.26 arc(10.88,11.01) 10.94,10.71 10.94,10.02 arc(10.99,9.76) 11.14,9.53 11.6,9.07 arc(11.78,8.79) 11.87,8.48 11.87,7.5 arc(11.88,7.32) 11.92,7.15 arc(12,6.96) 12.11,6.78 arc(12.16,6.72) 12.21,6.66 12.22,6.66 arc(12.24,6.63) 12.27,6.6 12.35,6.52 arc(12.37,6.5) 12.4,6.48 12.42,6.45 arc(12.48,6.4) 12.53,6.35 12.57,6.32 arc(12.63,6.27) 12.7,6.24 arc(12.81,6.19) 12.93,6.14 arc(13.12,6.09) 13.32,6.08 arc(13.49,6.11) 13.63,6.2 arc(13.84,6.35) 14.09,6.4 15.14,6.4 arc(15.26,6.37) 15.36,6.31 arc(15.44,6.25) 15.54,6.23 v2(18.35,6.23)
$1N40253: length 2.4
  Bottom Layer w0.254: U16.5 4.65,11.93 5.17,11.41 6.14,11.41
$1N41252: length 5
  Bottom Layer w0.152: 3.22,2.62 3.77,3.18 arc(3.91,3.37) 3.95,3.6 3.95,3.9 ; 3.95,3.9 3.95,4.02 arc(3.84,4.29) 3.58,4.39 3.24,4.39 arc(3.13,4.4) 3.02,4.39 2.9,4.39 2.9,4.39 arc(2.61,4.33) 2.37,4.17 arc(2.14,4.02) 1.87,3.97 1.27,3.97 ; 3.95,3.9 Q1.1
$1N41612: length 20.4
  Top Layer w0.508: v1(22.06,1.71) 21.59,1.71 21.58,1.71 arc(21.3,1.83) 21.18,2.11 21.18,2.24 arc(21.04,2.58) 20.7,2.72 8.22,2.72 arc(7.49,2.42) v1(7.18,1.68)
  Bottom Layer w0.508: v1(22.06,1.71) 21.66,1.71 arc(21.35,1.58) 21.22,1.27 LED1.1 ; LED2.1 R12.2 7.14,1.64 arc(7.17,1.66) v1(7.18,1.68)
$1N41730: length 1.4
  Bottom Layer w0.508: Q1.3 5.72,3.14 arc(5.69,3.07) R12.1

## Copper pours and planes (outline as drawn; the poured copper is in the pictures)
1.2V on Bottom Layer: 29.02,7.65 29.15,7.53 29.15,6.16 29,6 24.93,6 24.55,6.38 24.55,7.5 24.7,7.65
1.2V on Inner2: 9.89,2.34 9.43,1.87 9.43,0.47 9.11,0.16 5.78,0.16 1.61,3.09 1.61,3.73 2.4,3.73 6.74,0.98 8.23,0.98 8.6,1.35 8.6,2.37 9.32,3.09 20.66,3.09 21.53,2.23 21.53,1.33 21.86,0.99 23.97,0.99 28.38,4.09 28.38,6.61 28.22,6.78 26.74,6.78 26.54,6.98 26.54,7.5 26.74,7.7 28.7,7.7 29.23,7.17 29.23,3.68 24.4,0.24 20.85,0.24 20.6,0.49 20.6,1.84 20.11,2.34
3.3V on Top Layer: 20.05,12.35 20.68,12.35 20.81,12.21 20.81,10.85 20.51,10.55 18.71,10.55 18.69,10.58 18.69,11.15 18.71,11.18 19.74,11.18 19.89,11.33 19.89,12.2
3.3V on Bottom Layer: 22.82,5.14 23.43,5.14 23.51,5.06 23.51,3.74 23.61,3.64 23.79,3.64 23.87,3.56 23.87,2.88 23.78,2.8 21.86,2.8 21.15,3.51 21.15,4.2 21.27,4.33 22.52,4.33 22.65,4.46 22.65,4.97
3.3V on Bottom Layer: 3.52,8.34 4.46,8.34 4.6,8.2 4.6,7.9 4.69,7.81 6.69,7.81 6.87,7.63 6.87,6.31 6.57,6 3.52,6 3.33,6.2 3.33,8.15
3.3V on Bottom Layer: 2.2,16.21 2.81,16.21 2.88,16.14 2.88,15.51 3.3,15.09 3.3,14.16 3.2,14.06 2.5,14.06 2.1,14.46 2.1,16.12
3.3V on Inner2: 8.08,1.26 6.98,1.26 2.55,4.07 2.55,5.99 3.33,6.77 3.33,13.48 5.15,13.48 5.42,13.75 5.42,14.16 5.82,14.55 13.65,14.55 13.91,14.82 13.91,15.2 13.6,15.5 3.73,15.5 3.38,15.16 3.38,14.46 3.12,14.2 2.27,14.2 2.1,14.37 2.1,15.89 2.7,16.49 22.34,16.49 22.77,16.06 22.77,8.48 23.15,8.1 26.14,8.1 26.48,7.76 26.48,6.82 26.75,6.55 27.97,6.55 28.16,6.36 28.16,4.27 23.72,1.18 22.17,1.18 21.8,1.55 21.8,2.43 20.97,3.27 9.12,3.27 8.38,2.52 8.38,1.56
GND on Top Layer: 17.94,14.7 22.3,14.7 22.44,14.56 22.44,12.53 22.26,12.35 19.99,12.35 19.74,12.11 19.74,11.69 19.55,11.49 18.17,11.49 17.82,11.84 17.82,14.59
GND on Top Layer: 1.96,7.91 2.1,7.77 2.1,5.51 1.98,5.38 0.54,5.38 0.19,5.72 0.19,7.76 0.34,7.91
GND on Top Layer: 24.31,0.07 25.66,1.02 25.66,1.52 25.09,2.38 24.34,2.38 23.06,1.52 23.06,0.94 23.73,0.07
GND on Top Layer: 30.04,3.92 29.56,3.45 28.7,3.45 28,4.15 28,5.54 28.3,5.85 29.57,5.85 30.04,5.38
GND on Top Layer: 3.71,13.62 0.5,13.62 0.29,13.83 0.29,15.64 0.47,15.81 1.94,15.81 2.07,15.69 2.07,14.46 2.22,14.31 3.69,14.31 3.82,14.19 3.82,13.73
GND on Top Layer: 5.65,0.24 3.32,1.89 3.32,2.26 3.96,3.26 4.58,3.26 6.9,1.68 6.9,1.1 6.23,0.24
GND on Top Layer: 1.06,3.24 0.34,3.24 -0.35,3.93 -0.35,5.45 0,5.8 1.86,5.8 2.28,5.39 2.28,4.8
GND on Bottom Layer: 1.64,12.91 0.52,12.91 0.4,13.04 0.4,14.28 0.52,14.41 1.64,14.41 1.77,14.28 1.77,13.04
GND on Bottom Layer: 24.65,5.7 28.97,5.7 29.15,5.52 29.15,4.62 29.02,4.49 25.81,4.49 25.67,4.63 25.67,5.06 25.52,5.22 24.68,5.22 24.53,5.06 24.53,3.87 24.7,3.69 24.86,3.69 24.98,3.56 24.98,2.83 24.91,2.75 24.3,2.75 24.22,2.83 24.22,3.56 24.01,3.77 23.86,3.77 23.69,3.95 23.69,5.14 23.48,5.34 22.75,5.34 22.44,5.04 22.44,4.73 22.34,4.63 21.38,4.63 21.12,4.89 21.12,6 21.4,6.28 24.07,6.28
GND on Bottom Layer: 6.67,8.01 4.89,8.01 4.56,8.34 4.56,9.64 4.11,10.09 3.49,10.09 3.35,9.96 3.35,8.76 3.24,8.64 2.68,8.64 2.58,8.75 2.58,10.45 2.89,10.76 2.89,12.42 3.12,12.65 3.12,13.66 3.21,13.75 3.82,13.75 3.93,13.65 3.93,12.81 3.82,12.71 3.67,12.71 3.47,12.51 3.47,11.03 3.55,10.96 4.76,10.96 4.97,10.75 4.97,10.3 5.25,10.02 6.57,10.02 6.82,9.76 6.82,8.16
GND on Bottom Layer: 4.15,14 3.55,14 3.47,14.08 3.47,15.12 3.06,15.53 3.06,15.76 3.19,15.88 3.19,16.67 3.32,16.8 6.19,16.8 6.29,16.7 6.29,16.01 6.19,15.91 4.69,15.91 4.32,16.28 3.63,16.28 3.52,16.16 3.52,15.96 4.15,15.33
GND on Inner1: 0.24,17.23 23.79,17.23 23.79,8.7 30.29,8.7 30.29,3.23 27.09,0.03 2.91,0.03 -0.47,3.41 -0.47,16.52
VIN on Top Layer: 3.68,13.49 0.51,13.49 0.29,13.27 0.29,10.93 0.5,10.73 2.12,10.73 2.38,10.98 2.38,12.68 2.55,12.86 3.7,12.86 3.75,12.91 3.75,13.42
VIN on Bottom Layer: 0.45,12.73 1.74,12.73 1.97,12.96 1.97,13.65 2.07,13.75 2.94,13.75 3.04,13.65 3.04,12.84 2.86,12.66 2.63,12.66 2.43,12.45 2.43,10.96 2.25,10.78 0.45,10.78 0.24,10.99 0.24,12.53
$1N1778 on Top Layer: 17.94,11.53 17.34,11.53 17.34,12.51 17.13,12.71 17.13,13.59 17.21,13.67 17.77,13.67 17.82,13.62 17.82,12.81 17.95,12.68 17.95,11.54
$1N40257 on Bottom Layer: 1.46,9.95 2.37,9.95 2.43,9.89 2.43,5.98 2.35,5.9 1.49,5.9 1.41,5.98 1.41,9.9
